# EAGLE design amp_test_4 (EAGLE 7.6.0)
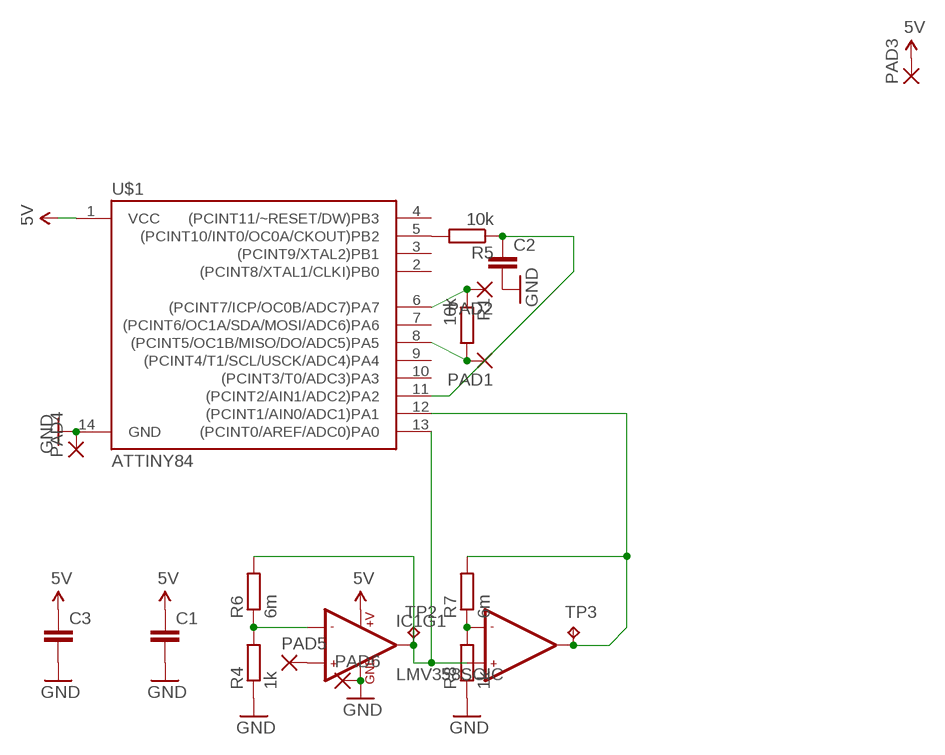
[diagram p0: schematic, sheet 1]

## Parts
C1  C-EUC0603  [C0603]
C2  C-EUC0603  [C0603]
C3  C-EUC0603  [C0603]
IC1  LMV358SOIC  [SO08]
PAD1  SMD5  [SMD2,54-5,08]
PAD2  SMD5  [SMD2,54-5,08]
PAD3  SMD5  [SMD2,54-5,08]
PAD4  SMD5  [SMD2,54-5,08]
PAD5  SMD5  [SMD2,54-5,08]
PAD6  SMD5  [SMD2,54-5,08]
R1  10k  R-EU_R0603  [R0603]
R4  1k  R-EU_R0603  [R0603]
R5  10k  R-EU_R0603  [R0603]
R6  6m  R-EU_R0603  [R0603]
R7  6m  R-EU_R0603  [R0603]
R8  1k  R-EU_R0603  [R0603]
TP2  TPTP20SQ  [TP20SQ]
TP3  TPTP20SQ  [TP20SQ]
U$1  ATTINY84  [SO14]

## Nets
5V: C1.1 C3.1 IC1.8(+V) PAD3.1(P) U$1.1(VCC)
GND: C1.2 C2.2 C3.2 IC1.4(GND) PAD4.1(P) PAD6.1(P) R4.1 R8.1 U$1.14(GND)
N$1: PAD1.1(P) R1.2 U$1.8((PCINT5/OC1B/MISO/DO/ADC5)PA5)
N$2: PAD2.1(P) R1.1 U$1.6((PCINT7/ICP/OC0B/ADC7)PA7)
N$8: R5.2 U$1.5((PCINT10/INT0/OC0A/CKOUT)PB2)
N$9: IC1.2(-IN1) R4.2 R6.1
N$10: IC1.1(OUT1) IC1.5(+IN2) R6.2 TP2.TP U$1.13((PCINT0/AREF/ADC0)PA0)
N$11: C2.1 R5.1 U$1.11((PCINT2/AIN1/ADC2)PA2)
N$12: IC1.7(OUT2) R7.2 TP3.TP U$1.12((PCINT1/AIN0/ADC1)PA1)
N$14: IC1.3(+IN1) PAD5.1(P)
N$15: IC1.6(-IN2) R7.1 R8.2
Unconnected: U$1.2((PCINT8/XTAL1/CLKI)PB0) U$1.3((PCINT9/XTAL2)PB1) U$1.4((PCINT11/~RESET/DW)PB3) U$1.7((PCINT6/OC1A/SDA/MOSI/ADC6)PA6) U$1.9((PCINT4/T1/SCL/USCK/ADC4)PA4) U$1.10((PCINT3/T0/ADC3)PA3)

## Library data of the parts
C1-C3 = rcl:C-EU: CAPACITOR, European symbol
IC1 = SparkFun-AnalogIC:LMV358: Jellybean rail-to-rail output op-amp; PROD_ID: IC-09657
PAD1-PAD6 = wirepad:SMD5: SMD PAD
R1 R4-R8 = rcl:R-EU_: RESISTOR, European symbol
TP2 TP3 = testpad:TP: Test pad
U$1 = SparkFun-DigitalIC:ATTINY84: Atmel 14-pin 2/4/8kB flash uC; PROD_ID: IC-11285

## Net classes
0 default: width 0.635 mm

## Board
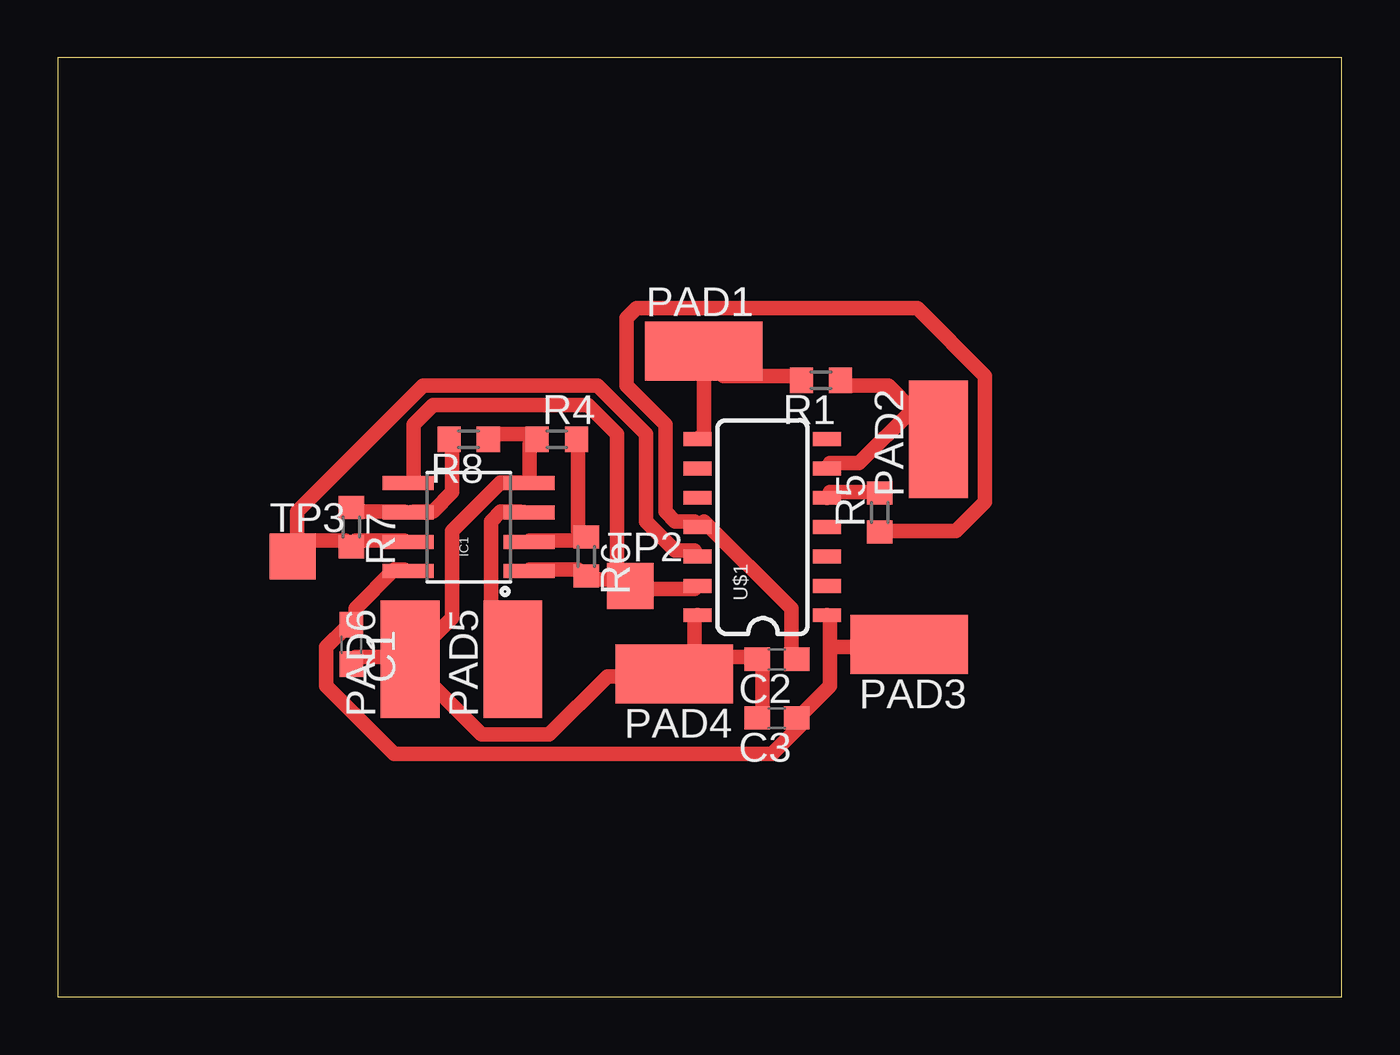
[diagram p1: board, top side]

Size 55.55 x 40.63 mm. Coordinates in mm from the lower left corner, seen from the top.
Outline: 0,0 55.55,0 55.55,40.63 0,40.63 0,0
Copper layers (1*16): Top 0.035mm / dielectric 1.5mm / Bottom 0.035mm
Design rules "default": minimum track width 10mil, minimum drill 24mil, track to track 8mil, track to pad 8mil, pad to pad 8mil, via to via 8mil, smd to smd 8mil, copper to edge 40mil, drill to drill 8mil, minimum pad ring 10mil, minimum via ring 8mil, stop-mask expansion 4mil, vias tented up to drill 0mil, thermal gap 10mil

### Footprints (pad centres in the part's own frame; a part is rotated, then mirrored left to right if it is on the bottom)
C0603 = smd 1.1 x 1: 1 -0.85,0; 2 0.85,0
SO08 = smd 0.61 x 2.21: 1 -1.905,-2.616; 2 -0.635,-2.616; 3 0.635,-2.616; 4 1.905,-2.616; 5 1.905,2.616; 6 0.635,2.616; 7 -0.635,2.616; 8 -1.905,2.616
SMD2,54-5,08 = smd 2.54 x 5.08: 1 0,0
R0603 = smd 1 x 1.1: 1 -0.85,0; 2 0.85,0
TP20SQ = smd 2 x 2: TP 0,0
SO14 = smd 0.6 x 1.2: 1 -3.81,-2.8; 2 -2.54,-2.8; 3 -1.27,-2.8; 4 0,-2.8; 5 1.27,-2.8; 6 2.54,-2.8; 7 3.81,-2.8; 8 3.81,2.8; 9 2.54,2.8; 10 1.27,2.8; 11 0,2.8; 12 -1.27,2.8; 13 -2.54,2.8; 14 -3.81,2.8

### Placement (x,y rotation side)
C1  12.7,15.24 270 top
C2  31.12,14.61 180 top
C3  31.12,12.07 180 top
IC1  17.78,20.32 90 top
PAD1  27.94,27.94 270 top
PAD2  38.1,24.13 0 top
PAD3  36.83,15.24 90 top
PAD4  26.67,13.97 90 top
PAD5  19.69,14.61 0 top
PAD6  15.24,14.61 0 top
R1  33.02,26.67 180 top
R4  21.59,24.13 0 top
R5  35.56,20.96 90 top
R6  22.86,19.05 270 top
R7  12.7,20.32 270 top
R8  17.78,24.13 180 top
TP2  24.77,17.78 0 top
TP3  10.16,19.05 0 top
U$1  30.48,20.32 90 top

### Tracks (layer width: path | path; a pad name or v marks a point on that pad's centre or on a via)
5V
  Top 0.635: IC1.8 14.97,18.48 14.55,18.48 12.88,16.8 12.88,16.38 C1.1 12.46,15.96 11.62,15.13 11.62,13.45 14.55,10.52 30.9,10.52 32.16,11.77 C3.1 32.16,12.19 33.41,13.45 33.41,15.13 | 33.41,15.13 33.41,16.38 U$1.1 | 33.41,15.13 36.77,15.13 PAD3.1
GND
  Top 0.635: C3.2 30.48,12.19 30.48,14.29 C2.2 30.06,14.71 27.55,14.71 PAD4.1 | U$1.14 27.55,16.38 27.55,15.13 26.71,14.29 PAD4.1 | 26.71,13.87 PAD4.1 | R8.1 18.74,24.35 20.42,24.35 R4.1 20.42,23.93 20.42,22.25 IC1.4 20,22.25 19.16,22.25 17.07,20.16 17.07,16.38 15.39,14.71 PAD6.1 | C1.2 12.88,14.71 14.97,14.71 PAD6.1 | PAD4.1 26.29,13.87 23.77,13.87 21.26,11.35 18.33,11.35 15.39,14.29 PAD6.1
N$1
  Top 0.635: R1.2 32.16,26.86 28.8,26.86 27.96,27.7 PAD1.1 | U$1.8 27.96,24.35 27.96,27.28 PAD1.1 | 27.96,28.12 PAD1.1
N$2
  Top 0.635: 36.98,25.39 38.02,24.35 PAD2.1 | 36.98,25.39 35.93,26.44 34.25,26.44 R1.1 | 36.98,25.39 34.67,23.09 33.41,23.09 U$1.6
N$8
  Top 0.635: R5.2 35.51,21.83 33.41,21.83 U$1.5
N$9
  Top 0.635: IC1.2 20.42,19.74 22.52,19.74 R6.1 22.52,20.16 22.52,23.93 R4.2
N$10
  Top 0.635: 24.19,18.06 24.61,18.06 TP2.TP | 24.19,18.06 22.94,18.06 R6.2 22.52,18.48 20.42,18.48 IC1.1 | U$1.13 27.55,17.64 25.03,17.64 TP2.TP | 24.19,18.06 24.19,24.35 22.94,25.6 16.23,25.6 15.39,24.77 15.39,22.25 IC1.5 | 24.19,18.06 TP2.TP
N$11
  Top 0.635: C2.1 31.74,14.71 31.74,16.8 27.96,20.57 U$1.11 27.55,20.57 26.71,20.57 26.29,20.99 26.29,24.77 24.61,26.44 24.61,29.38 25.03,29.79 37.19,29.79 40.12,26.86 40.12,21.41 38.86,20.16 35.93,20.16 R5.1
N$12
  Top 0.635: IC1.7 14.97,19.74 12.88,19.74 R7.2 12.46,19.74 10.36,19.74 | 10.36,19.74 10.36,19.32 TP3.TP 10.36,19.74 | 10.36,19.74 10.36,20.99 15.81,26.44 23.35,26.44 25.45,24.35 25.45,20.57 26.71,19.32 27.55,19.32 U$1.12
N$14
  Top 0.635: PAD5.1 18.74,15.55 18.74,20.57 19.16,20.99 20,20.99 IC1.3
N$15
  Top 0.635: 17.07,24.35 R8.2 17.07,23.93 17.07,21.83 16.23,20.99 15.39,20.99 IC1.6 14.97,20.99 12.88,20.99 R7.1